# EAGLE design HoneywellPressurePCB (EAGLE 9.3.1)
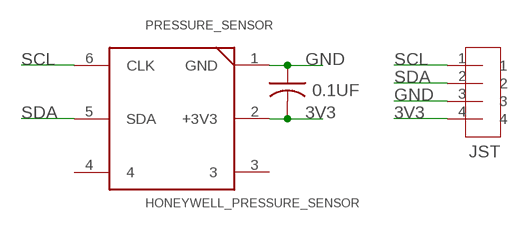
[diagram p0: schematic, sheet 1]

## Parts
0.1UF  C-USC1206  [C1206]
JST  2.5MM_JST_UP_4POS  [JST_4POS_2.5MM_UP]
PRESSURE_SENSOR  HONEYWELL_PRESSURE_SENSOR  [DIP6]

## Nets
3V3: 0.1UF.2 JST.4 PRESSURE_SENSOR.2(+3V3)
GND: 0.1UF.1 JST.3 PRESSURE_SENSOR.1(GND)
SCL: JST.1 PRESSURE_SENSOR.6(CLK)
SDA: JST.2 PRESSURE_SENSOR.5(SDA)
Unconnected: PRESSURE_SENSOR.3 PRESSURE_SENSOR.4

## Library data of the parts
0.1UF = adafruit:C-US: CAPACITOR, American symbol
JST = eDNA:2.5MM_JST_UP_4POS: 2.5mm JST, 4POS, 4 position
PRESSURE_SENSOR = eDNA:HONEYWELL_PRESSURE_SENSOR

## Board
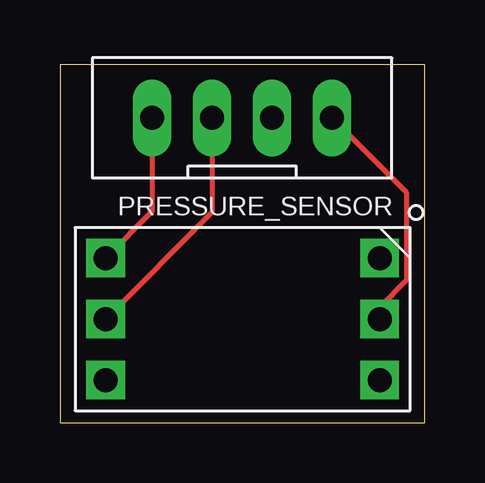
[diagram p1: board, top side]
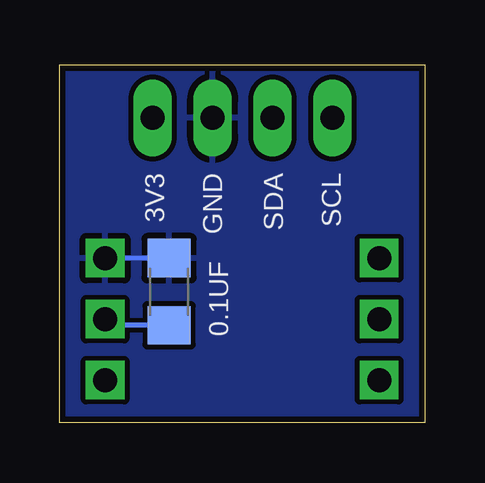
[diagram p2: board, bottom side, seen from below]

Size 15.22 x 14.91 mm. Coordinates in mm from the lower left corner, seen from the top.
Outline: 0,0 15.22,0 15.22,14.91 0,14.91 0,0
Copper layers (1*16): Top 0.035mm / dielectric 1.5mm / Bottom 0.035mm
Design rules "SparkFun": minimum track width 8mil, minimum drill 20mil, track to track 8mil, track to pad 8mil, pad to pad 8mil, via to via 8mil, smd to smd 8mil, copper to edge 10mil, drill to drill 8mil, minimum pad ring 12mil, minimum via ring 10mil, stop-mask expansion 4mil, vias tented up to drill 25mil, thermal gap 10mil

### Footprints (pad centres in the part's own frame; a part is rotated, then mirrored left to right if it is on the bottom)
C1206 = smd 1.6 x 1.8: 1 -1.4,0; 2 1.4,0
JST_4POS_2.5MM_UP = drill 1 long: 1 -2.5,0; 2 0,0; 3 2.5,0; 4 5,0
DIP6 = drill 1 square: 1 0,0; 2 0,-2.54; 3 0,-5.08; 4 -11.43,-5.08; 5 -11.43,-2.54; 6 -11.43,0

### Placement (x,y rotation side)
0.1UF  10.67,5.46 270 bottom
JST  6.35,12.7 0 top
PRESSURE_SENSOR  13.34,6.86 0 top

### Tracks (layer width: path | path; a pad name or v marks a point on that pad's centre or on a via)
3V3
  Top 0.203: PRESSURE_SENSOR.2 13.34,4.82 14.45,5.93 14.45,9.61 JST.4
  Bottom 0.203: 0.1UF.2 13.08,4.06 PRESSURE_SENSOR.2
GND
  Bottom 0.203: 0.1UF.1 PRESSURE_SENSOR.1
  pour Bottom: 0,15.24 15.24,15.24 15.24,0 0,0
SCL
  Top 0.203: JST.1 3.85,8.8 PRESSURE_SENSOR.6
SDA
  Top 0.203: JST.2 6.35,8.76 PRESSURE_SENSOR.5

### Text on the board
bPlace: SCL | SDA | GND | 3V3